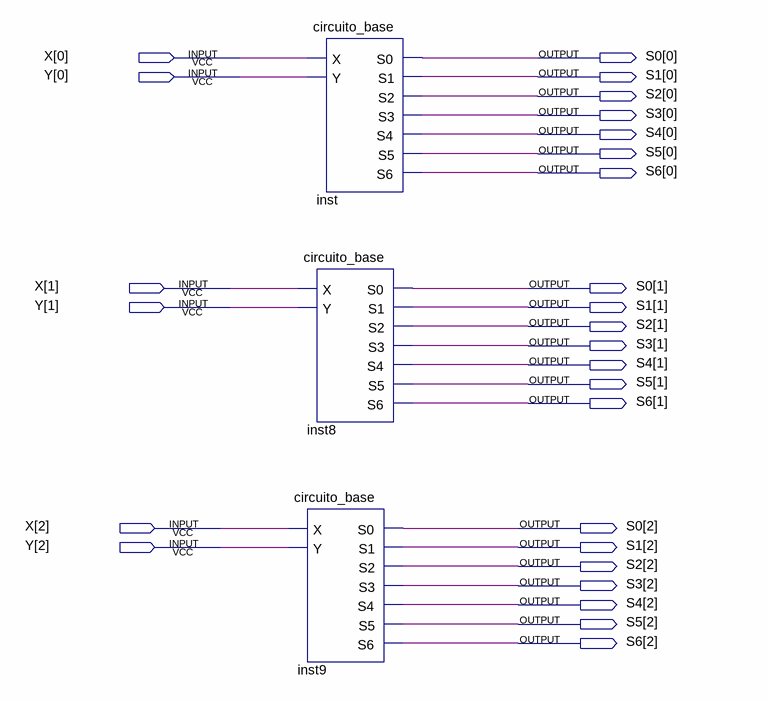
[diagram p0: schematic sheet]
// Quartus schematic Projeto_alf.bdf as structural Verilog: 3 symbols, 27 pins
module Projeto_alf (
  input  [2:0] X,
  input  [2:0] Y,
  output [2:0] S0,
  output [2:0] S1,
  output [2:0] S2,
  output [2:0] S3,
  output [2:0] S4,
  output [2:0] S5,
  output [2:0] S6
);

  circuito_base inst (
    .X(X[0]), .Y(Y[0]), .S0(S0[0]), .S1(S1[0]), .S2(S2[0]), .S3(S3[0]), .S4(S4[0]), .S5(S5[0]), .S6(S6[0]));
  circuito_base inst8 (
    .X(X[1]), .Y(Y[1]), .S0(S0[1]), .S1(S1[1]), .S2(S2[1]), .S3(S3[1]), .S4(S4[1]), .S5(S5[1]), .S6(S6[1]));
  circuito_base inst9 (
    .X(X[2]), .Y(Y[2]), .S0(S0[2]), .S1(S1[2]), .S2(S2[2]), .S3(S3[2]), .S4(S4[2]), .S5(S5[2]), .S6(S6[2]));
endmodule
